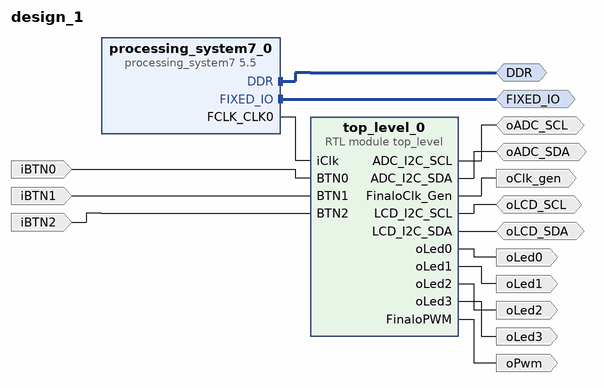
[diagram p0: block diagram of the top level]
# Vivado block design design_1, xc7z010clg225-1, Vivado 2019.1
create_bd_design design_1

create_bd_intf_port -mode Master -vlnv xilinx.com:interface:ddrx_rtl:1.0 DDR
create_bd_intf_port -mode Master -vlnv xilinx.com:display_processing_system7:fixedio_rtl:1.0 FIXED_IO
create_bd_port -dir O oLed0
create_bd_port -dir O oLed1
create_bd_port -dir O oLed2
create_bd_port -dir O oLed3
create_bd_port -dir O oPwm
create_bd_port -dir O oClk_gen
create_bd_port -dir IO oADC_SDA
create_bd_port -dir IO oADC_SCL
create_bd_port -dir IO oLCD_SDA
create_bd_port -dir IO oLCD_SCL
create_bd_port -dir I iBTN0
create_bd_port -dir I iBTN1
create_bd_port -dir I iBTN2

create_bd_cell -type ip -vlnv xilinx.com:ip:processing_system7:5.5 processing_system7_0
set_property -dict [list \
  CONFIG.PCW_CRYSTAL_PERIPHERAL_FREQMHZ 33.33333 \
  CONFIG.PCW_GPIO_MIO_GPIO_ENABLE 1 \
  CONFIG.PCW_GPIO_MIO_GPIO_IO MIO \
  CONFIG.PCW_I2C1_I2C1_IO {MIO 48 .. 49} \
  CONFIG.PCW_I2C1_PERIPHERAL_ENABLE 1 \
  CONFIG.PCW_I2C_PERIPHERAL_FREQMHZ 111.111107 \
  CONFIG.PCW_I2C_RESET_ENABLE 0 \
  CONFIG.PCW_PRESET_BANK1_VOLTAGE {LVCMOS 3.3V} \
  CONFIG.PCW_QSPI_GRP_SINGLE_SS_ENABLE 1 \
  CONFIG.PCW_QSPI_GRP_SINGLE_SS_IO {MIO 1 .. 6} \
  CONFIG.PCW_QSPI_PERIPHERAL_ENABLE 1 \
  CONFIG.PCW_QSPI_QSPI_IO {MIO 1 .. 6} \
  CONFIG.PCW_SD1_GRP_CD_ENABLE 1 \
  CONFIG.PCW_SD1_GRP_CD_IO 0 \
  CONFIG.PCW_SD1_PERIPHERAL_ENABLE 1 \
  CONFIG.PCW_SD1_SD1_IO {MIO 10 .. 15} \
  CONFIG.PCW_SDIO_PERIPHERAL_FREQMHZ 100 \
  CONFIG.PCW_SINGLE_QSPI_DATA_MODE x4 \
  CONFIG.PCW_TTC0_PERIPHERAL_ENABLE 1 \
  CONFIG.PCW_TTC0_TTC0_IO EMIO \
  CONFIG.PCW_TTC1_PERIPHERAL_ENABLE 1 \
  CONFIG.PCW_TTC1_TTC1_IO EMIO \
  CONFIG.PCW_UART1_PERIPHERAL_ENABLE 1 \
  CONFIG.PCW_UART1_UART1_IO {MIO 8 .. 9} \
  CONFIG.PCW_UART_PERIPHERAL_FREQMHZ 100 \
  CONFIG.PCW_UIPARAM_DDR_MEMORY_TYPE {DDR 3 (Low Voltage)} \
  CONFIG.PCW_UIPARAM_DDR_PARTNO {MT41J64M16 JT-125G} \
  CONFIG.PCW_USB0_PERIPHERAL_ENABLE 1 \
  CONFIG.PCW_USB0_USB0_IO {MIO 28 .. 39} \
  CONFIG.PCW_USB_RESET_ENABLE 0 \
  CONFIG.PCW_USE_M_AXI_GP0 0 \
  CONFIG.PCW_WDT_PERIPHERAL_ENABLE 1 \
  CONFIG.PCW_WDT_WDT_IO EMIO \
] [get_bd_cells processing_system7_0]
# 149 more settings of processing_system7_0 are not shown: defaults, MIO pin electricals, DDR timing, and values the tool derives
create_bd_cell -type module -reference top_level top_level_0

# ---- connections ----

connect_bd_intf_net [get_bd_intf_ports DDR] [get_bd_intf_pins processing_system7_0/DDR]
connect_bd_intf_net [get_bd_intf_ports FIXED_IO] [get_bd_intf_pins processing_system7_0/FIXED_IO]
connect_bd_net [get_bd_pins processing_system7_0/FCLK_CLK0] [get_bd_pins top_level_0/iClk]
connect_bd_net -net iBTN0_1 [get_bd_ports iBTN0] [get_bd_pins top_level_0/BTN0]
connect_bd_net -net iBTN1_1 [get_bd_ports iBTN1] [get_bd_pins top_level_0/BTN1]
connect_bd_net -net iBTN2_1 [get_bd_ports iBTN2] [get_bd_pins top_level_0/BTN2]
connect_bd_net [get_bd_pins top_level_0/oLed0] [get_bd_ports oLed0]
connect_bd_net [get_bd_pins top_level_0/oLed1] [get_bd_ports oLed1]
connect_bd_net [get_bd_pins top_level_0/oLed2] [get_bd_ports oLed2]
connect_bd_net [get_bd_pins top_level_0/oLed3] [get_bd_ports oLed3]
connect_bd_net [get_bd_pins top_level_0/FinaloPWM] [get_bd_ports oPwm]
connect_bd_net [get_bd_pins top_level_0/FinaloClk_Gen] [get_bd_ports oClk_gen]
connect_bd_net [get_bd_ports oADC_SCL] [get_bd_pins top_level_0/ADC_I2C_SCL]
connect_bd_net [get_bd_ports oADC_SDA] [get_bd_pins top_level_0/ADC_I2C_SDA]
connect_bd_net [get_bd_ports oLCD_SCL] [get_bd_pins top_level_0/LCD_I2C_SCL]
connect_bd_net [get_bd_ports oLCD_SDA] [get_bd_pins top_level_0/LCD_I2C_SDA]

validate_bd_design
save_bd_design
